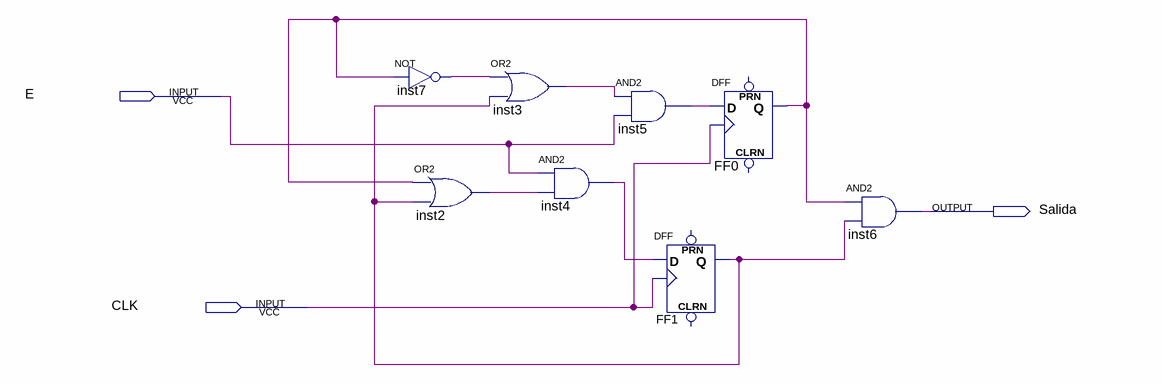
[diagram p0: schematic sheet]
// Quartus schematic practica2_ff.bdf as structural Verilog: 8 symbols, 3 pins
module practica2_ff (
  input  E,
  input  CLK,
  output Salida
);

  wire FF0_q, FF1_q, inst2_out, inst3_out, inst4_out, inst5_out, inst7_out;

  not inst7 (inst7_out, FF0_q);
  or inst2 (inst2_out, FF0_q, FF1_q);
  or inst3 (inst3_out, inst7_out, FF1_q);
  and inst4 (inst4_out, E, inst2_out);
  and inst5 (inst5_out, inst3_out, E);
  DFF FF0 (.CLK(CLK), .D(inst5_out), .Q(FF0_q));  // open: CLRN, PRN
  DFF FF1 (.CLK(CLK), .D(inst4_out), .Q(FF1_q));  // open: CLRN, PRN
  and inst6 (Salida, FF0_q, FF1_q);
endmodule
